# Altium schematic sheet RemoteLabs.SchDoc
size A4
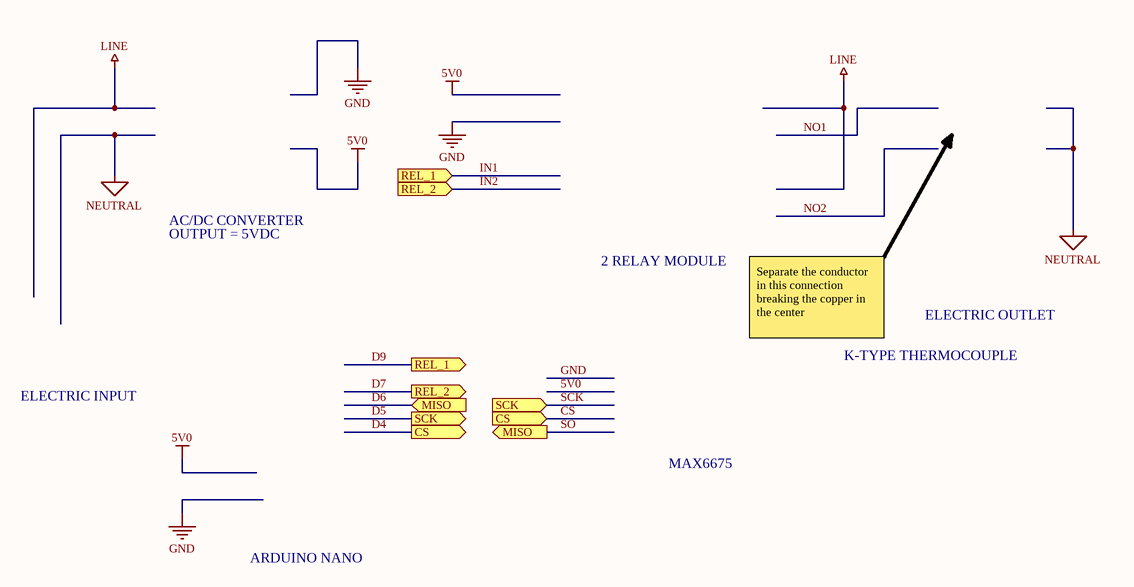
[diagram p0: RemoteLabs.SchDoc]

## Ports
CS (in), CS (out), MISO (in), MISO (out), REL_1 (in), REL_1 (out), REL_2 (in), REL_2 (out), SCK (in), SCK (out)

## Nets
CS: port CS  [also labelled D4]
D5: port SCK  [also labelled SCK]
D6: port MISO  [also labelled SO]
D7: port REL_2  [also labelled IN2]
D9: port REL_1  [also labelled IN1]

## Notes on the sheet
- AC/DC CONVERTER
- OUTPUT = 5VDC
- 2 RELAY MODULE
- Separate the conductor in this connection breaking the copper in the center
- K-TYPE THERMOCOUPLE
- ELECTRIC OUTLET
- ELECTRIC INPUT
- MAX6675
- ARDUINO NANO